# EasyEDA schematic SCH_Interrupt.json

## Sheets
1 Arduino: TITLE: Schematic; REV: 1.0; Date: 2022-10-14; Sheet: 1/1; Company: Hogent
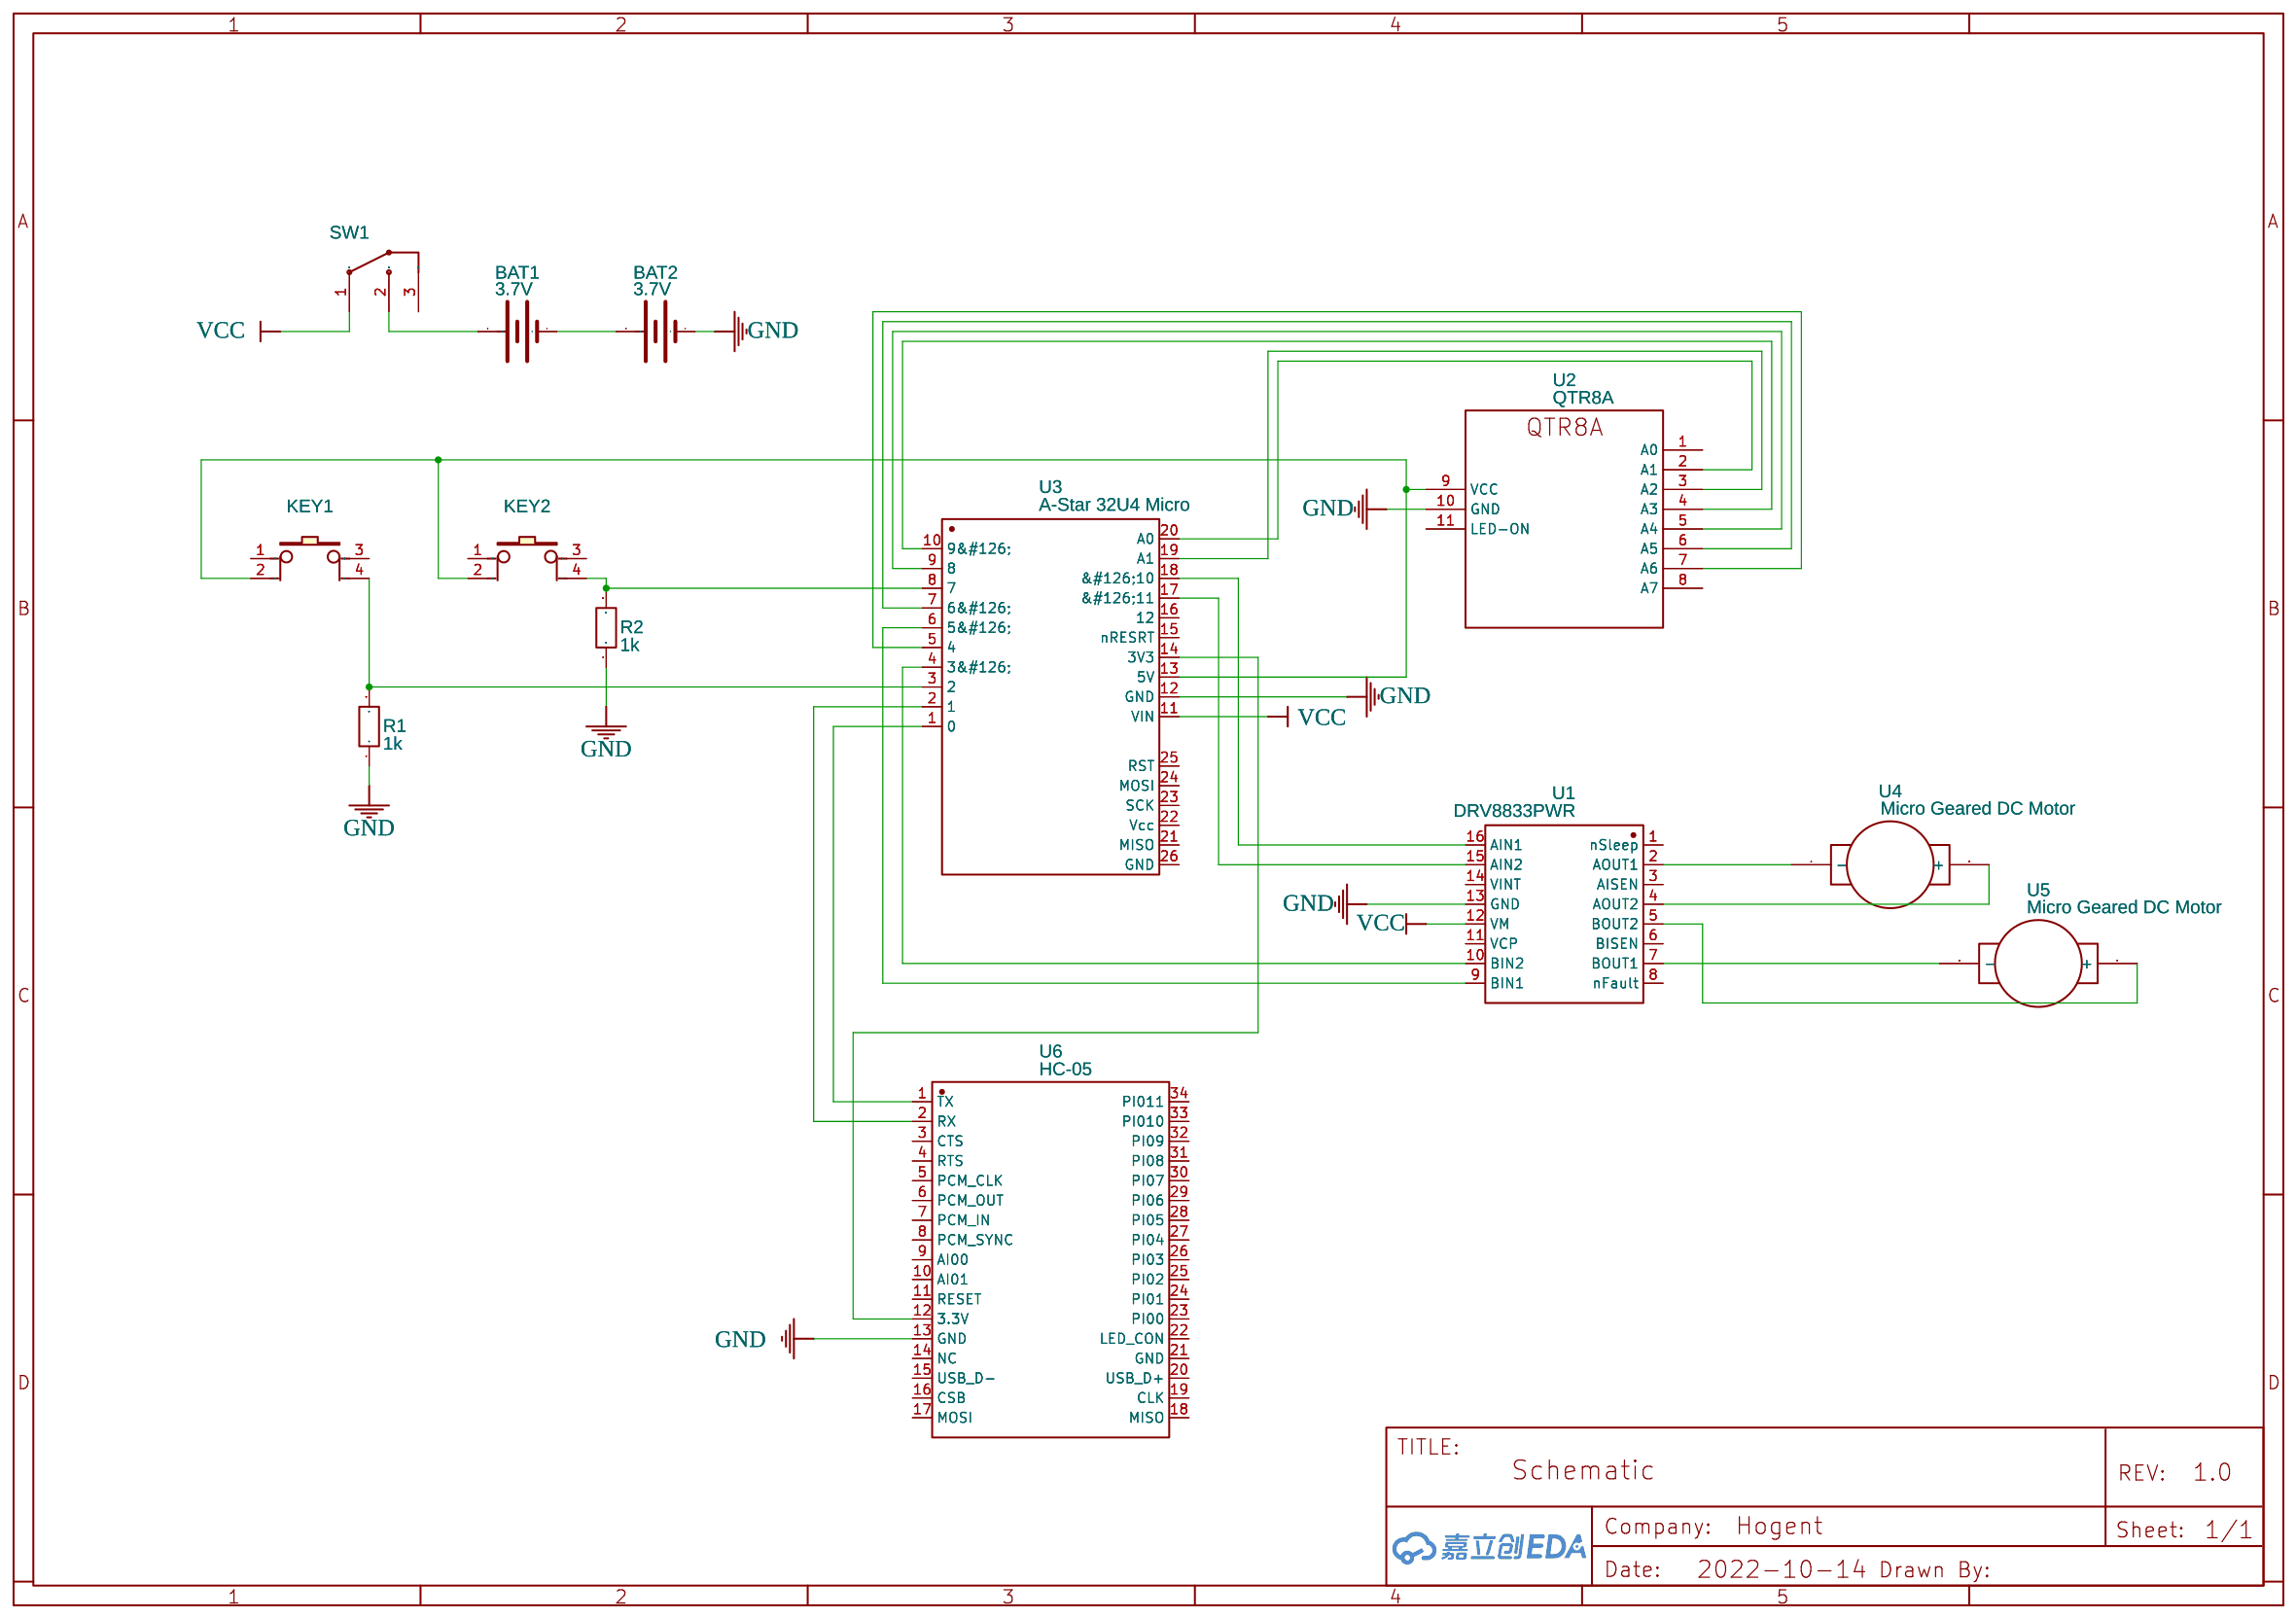
[diagram p0: Arduino]
2 Sheet_1: TITLE: Interrupt; Date: 2022-12-23
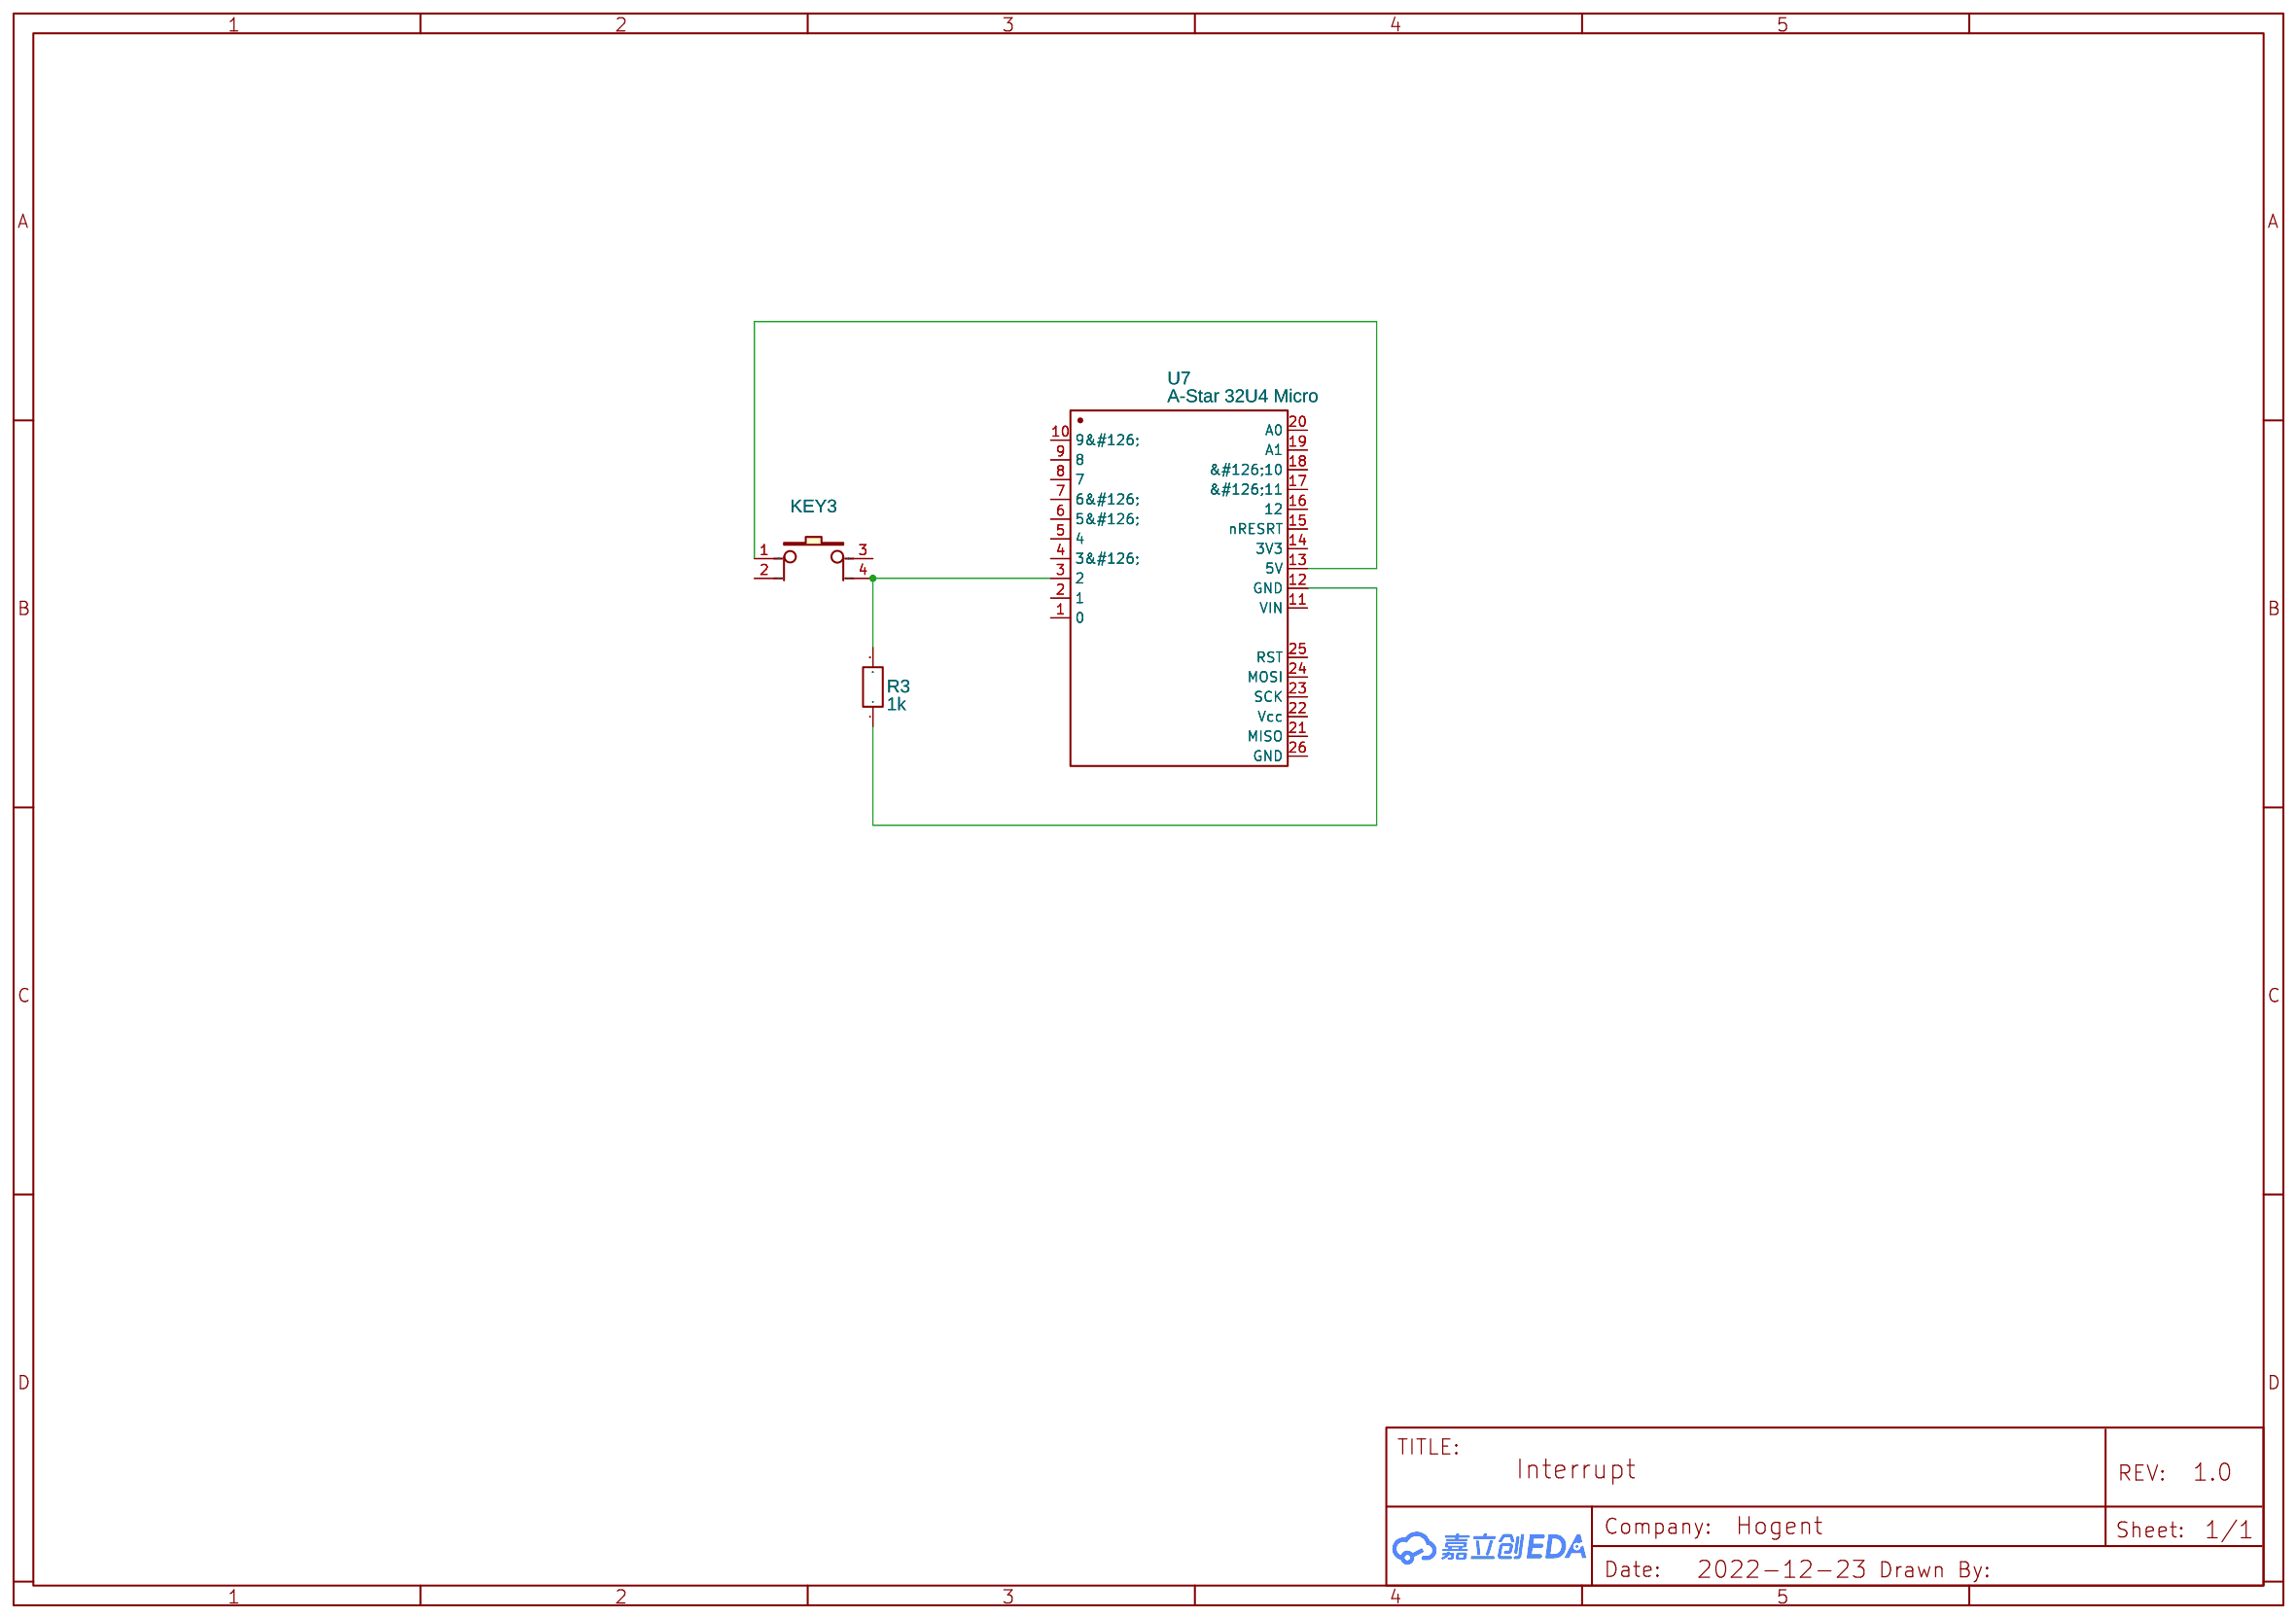
[diagram p1: Sheet_1]
3 Sheet_2: TITLE: Sheet_2; Date: 2022-12-23; Company: Your Company
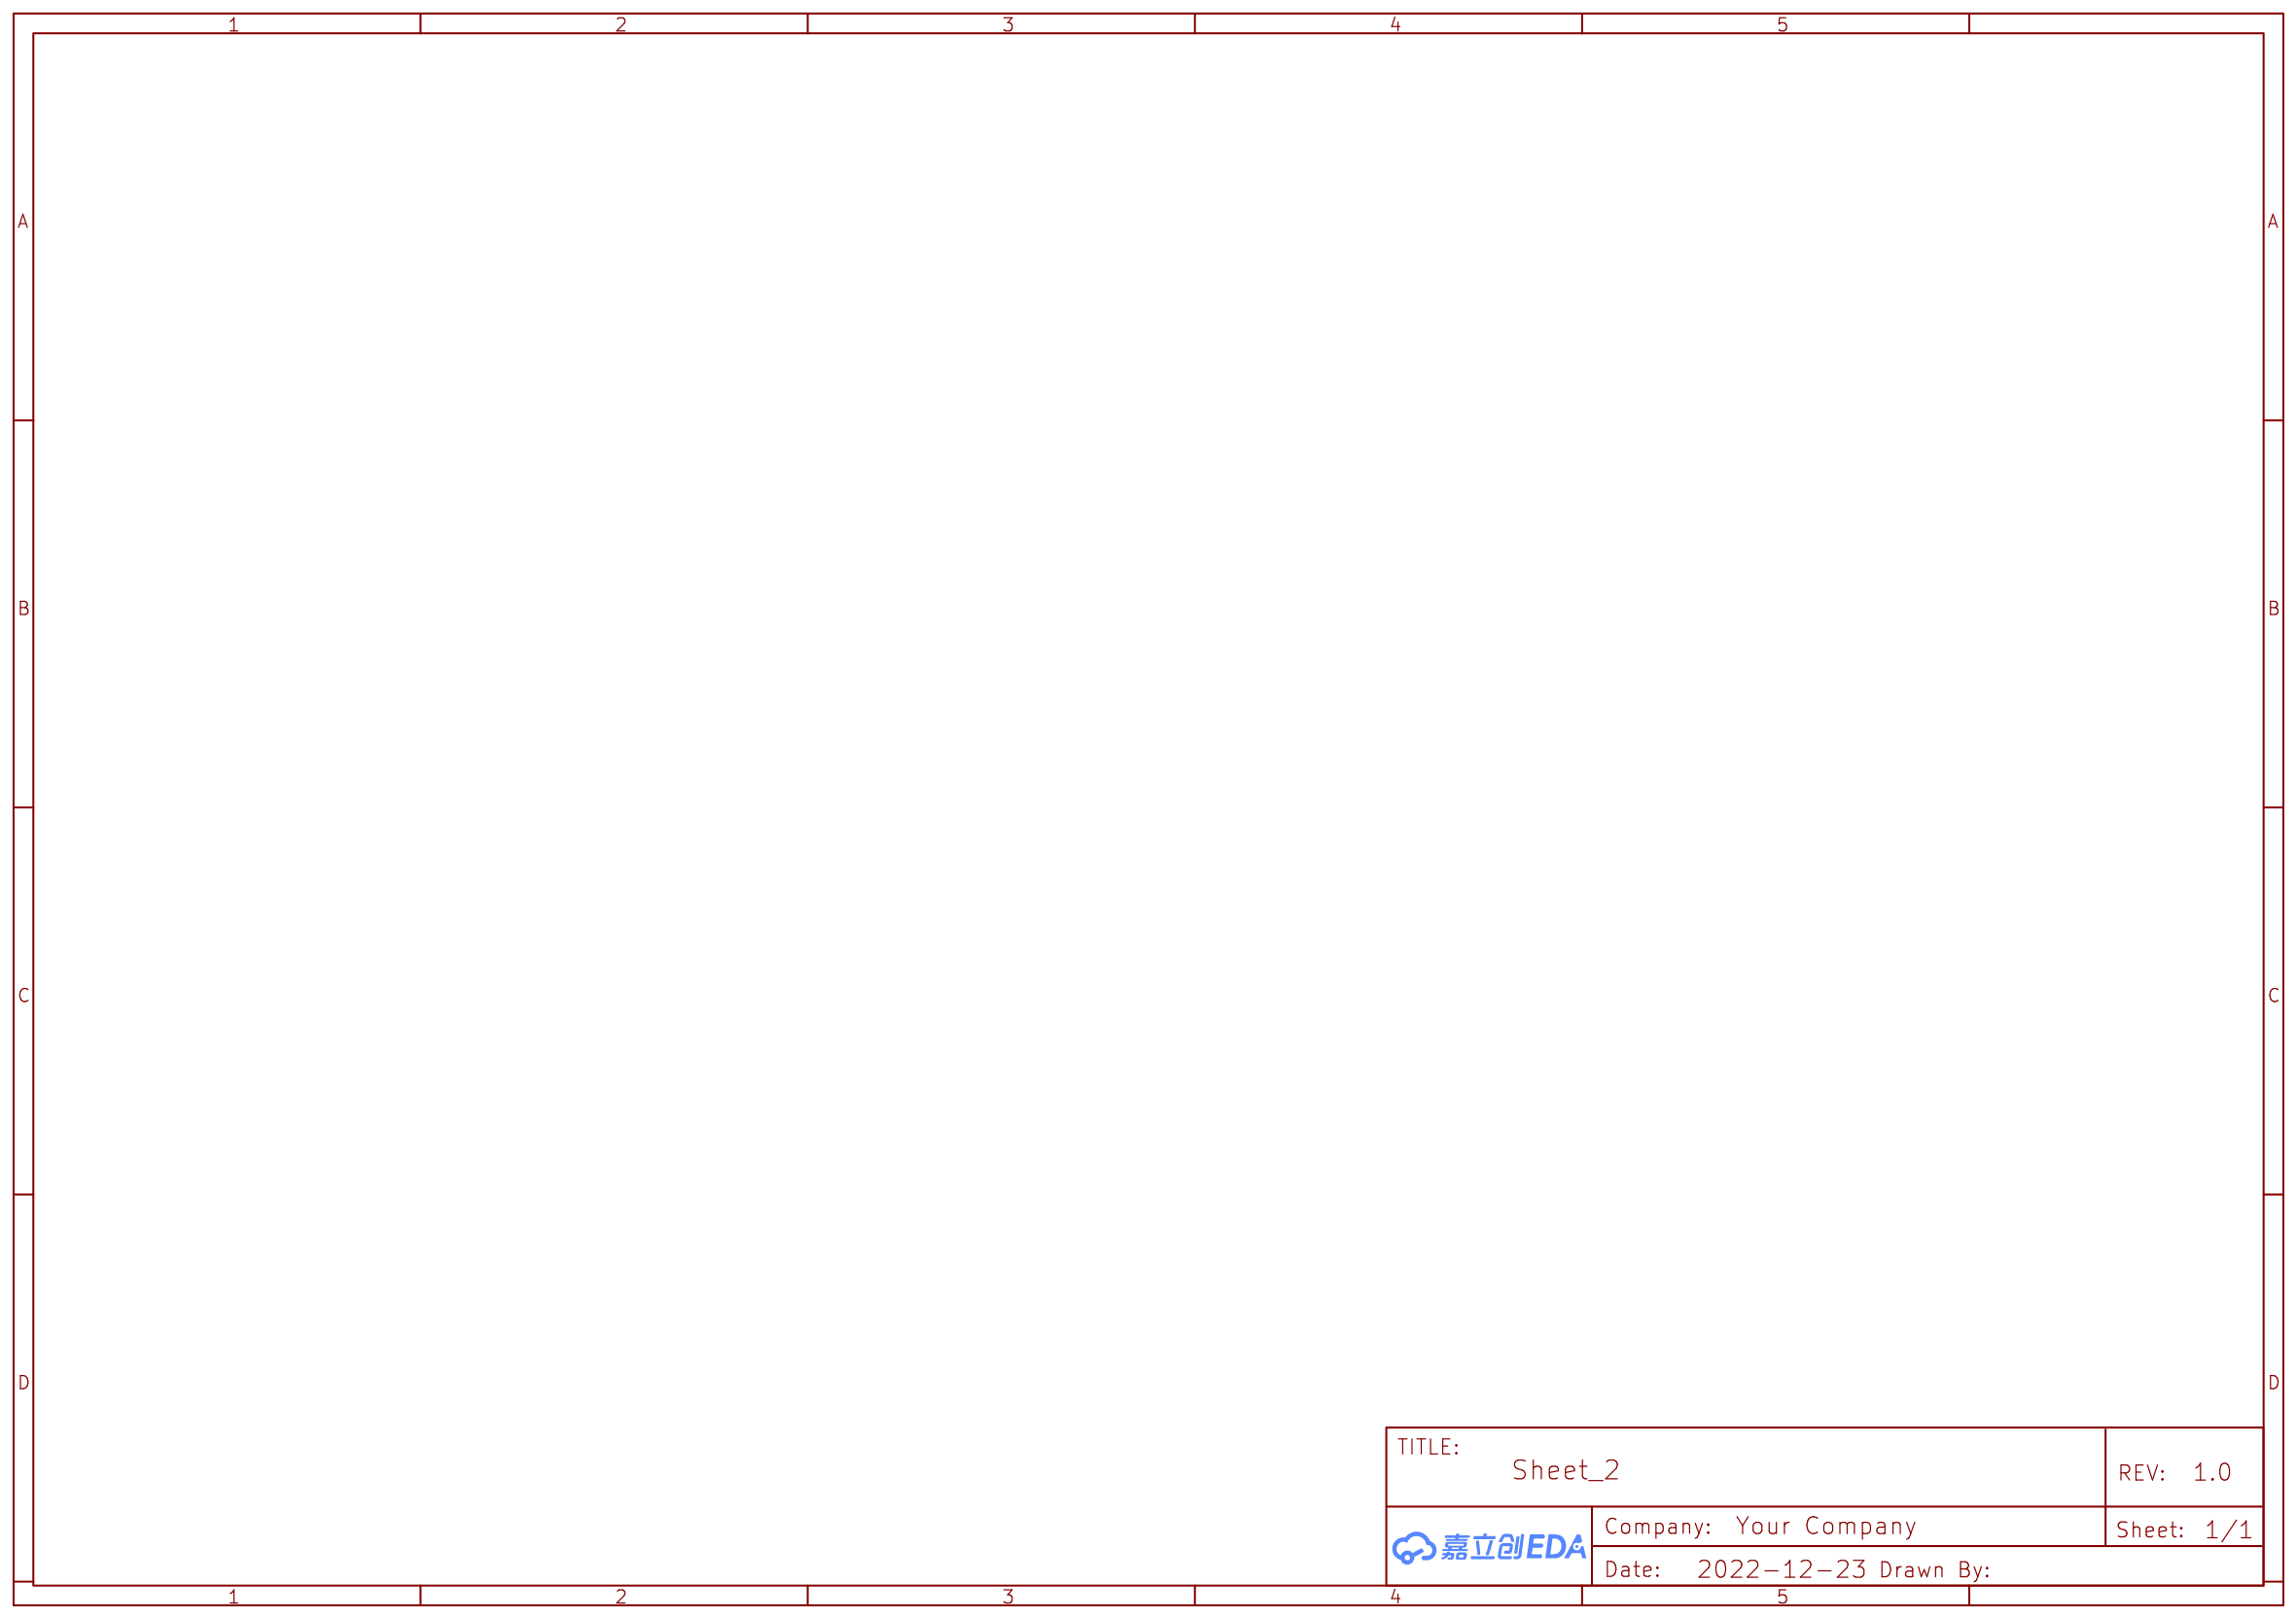
[diagram p2: Sheet_2]

## Parts
sheet Arduino
BAT1  3.7V  [LIPO-110-TABS]
BAT2  3.7V  [LIPO-110-TABS]
KEY1  button6*6*8.5  [KEY-TH_4P-L6.0-W6.0-P4.50]
KEY2  button6*6*8.5  [KEY-TH_4P-L6.0-W6.0-P4.50]
R1  1k  [R0603]
R2  1k  [R0603]
SW1  Jaw handle left twins ROHS 100g Micro Switch  [KEY-TH_100GMICROSWITCH]
U1  DRV8833PWR  [TSSOP-16_L5.0-W4.4-P0.65-LS6.4-BL]
U2  QTR8A  [QTR8A]
U3  A-Star 32U4 Micro  [A-STAR 32U4 MICRO]
U4  Micro Geared DC Motor  [MICRO GEARED DC MOTOR PADS]
U5  Micro Geared DC Motor  [MICRO GEARED DC MOTOR PADS]
U6  HC-05  [BULETM-SMD_HC-05]
sheet Sheet_1
KEY3  button6*6*8.5  [KEY-TH_4P-L6.0-W6.0-P4.50]
R3  1k  [R0603]
U7  A-Star 32U4 Micro  [A-STAR 32U4 MICRO]

## Library data of the parts
BAT1 BAT2 = BATTERYLIPO-TABS: Battery Holders; Contributor: SparkFun
KEY1-KEY3 = button6*6*8.5: Supplier Part: C59980; Supplier: LCSC; Manufacturer: ReliaPro
R1-R3 = R_0603_EU: Contributor: LCEDA_Lib
SW1 = Jaw handle left twins ROHS 100g Micro Switch: Supplier: LCSC; Manufacturer: ReliaPro; Supplier Part: C3668
U1 = DRV8833PWR: Supplier: LCSC; Supplier Part: C544801; Manufacturer: TI(德州仪器); Contributor: LCSC
U2 = QTR8A: Manufacturer: POLOLU; Supplier: POLOLU; link: https://www.pololu.com/product/960/pictures; Contributor: yeison buitrago rojas
U3 U7 = A-Star 32U4 Micro: Manufacturer: pololu; Manufacturer Part: 3101; Supplier: Pololu; link: https://www.4project.co.il/documents/doc_3710_3255.pdf; Contributor: Roi_Doitch
U4 U5 = Micro Geared DC Motor: link: https://www.amazon.com/dp/B07N7PY71F?psc=1&ref=ppx_yo2ov_dt_b_product_details; Contributor: Guest
U6 = HC-05: Supplier: LCSC; Supplier Part: C9900001063; Manufacturer: null; JLCPCB Part Class: Extended Part; Contributor: LCSC

## Nets
GND: BAT2.- R1.1 R2.1 U1.13(GND) U2.10(GND) U3.12(GND) U6.13(GND)
VCC: SW1.1 U1.12(VM) U3.11(VIN)
Net-(BAT1-+): BAT1.+ SW1.2
Net-(BAT1--): BAT1.- BAT2.+
Net-(KEY1-2): KEY1.2 KEY2.2 U2.9(VCC) U3.13(5V)
Net-(KEY1-4): KEY1.4 R1.2 U3.3(2)
Net-(KEY2-4): KEY2.4 R2.2 U3.8(7)
Net-(KEY3-1): KEY3.1 U7.13(5V)
Net-(KEY3-4): KEY3.4 R3.2 U7.3(2)
Net-(R3-1): R3.1 U7.12(GND)
Net-(U1-2): U1.2(AOUT1) U4.1(-)
Net-(U1-4): U1.4(AOUT2) U4.2(+)
Net-(U1-5): U1.5(BOUT2) U5.2(+)
Net-(U1-7): U1.7(BOUT1) U5.1(-)
Net-(U1-9): U1.9(BIN1) U3.6(5&#126;)
Net-(U1-10): U1.10(BIN2) U3.4(3&#126;)
Net-(U1-15): U1.15(AIN2) U3.17(&#126;11)
Net-(U1-16): U1.16(AIN1) U3.18(&#126;10)
Net-(U2-2): U2.2(A1) U3.20(A0)
Net-(U2-3): U2.3(A2) U3.19(A1)
Net-(U2-4): U2.4(A3) U3.10(9&#126;)
Net-(U2-5): U2.5(A4) U3.9(8)
Net-(U2-6): U2.6(A5) U3.7(6&#126;)
Net-(U2-7): U2.7(A6) U3.5(4)
Net-(U3-1): U3.1(0) U6.1(TX)
Net-(U3-2): U3.2(1) U6.2(RX)
Net-(U3-14): U3.14(3V3) U6.12(3.3V)

Not connected (* = marked no-connect by the designer): KEY1 1 3; KEY2 1 3; KEY3 2 3; SW1 3; U1 1(nSleep) 3(AISEN) 6(BISEN) 8(nFault) 11(VCP) 14(VINT); U2 1(A0) 8(A7) 11(LED-ON); U3 15(nRESRT) 16(12) 21(MISO) 22(Vcc) 23(SCK) 24(MOSI) 25(RST) 26(GND); U6 3(CTS) 4(RTS) 5(PCM_CLK) 6(PCM_OUT) 7(PCM_IN) 8(PCM_SYNC) 9(AI00) 10(AI01) 11(RESET) 14(NC) 15(USB_D-) 16(CSB) 17(MOSI) 18(MISO) 19(CLK) 20(USB_D+) 21(GND) 22(LED_CON) 23(PI00) 24(PI01) 25(PI02) 26(PI03) 27(PI04) 28(PI05) 29(PI06) 30(PI07) 31(PI08) 32(PI09) 33(PI010) 34(PI011); U7 1(0) 2(1) 4(3&#126;) 5(4) 6(5&#126;) 7(6&#126;) 8(7) 9(8) 10(9&#126;) 11(VIN) 14(3V3) 15(nRESRT) 16(12) 17(&#126;11) 18(&#126;10) 19(A1) 20(A0) 21(MISO) 22(Vcc) 23(SCK) 24(MOSI) 25(RST) 26(GND)
